# Altium project 4-wire-short.PrjPcb
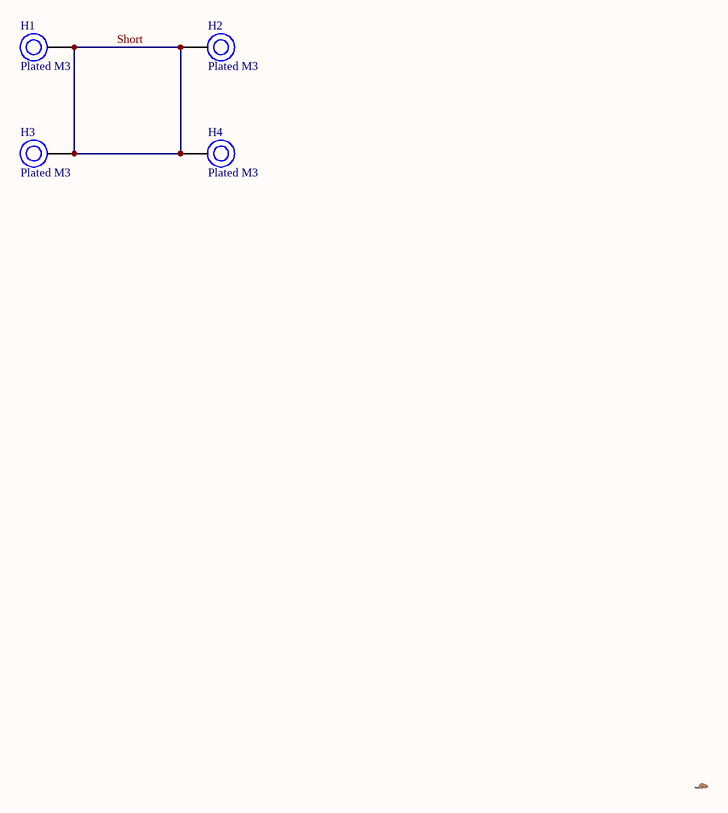
[diagram p0: main.SchDoc]
1 sheet, 5 parts. Net scope: global (net labels, ports and power ports of the same name join across sheets).
Board file: main.PcbDoc

## Sheet main.SchDoc: 4-wire-short
size 420 x 297 mm; Date: 2021-12-08; Author: Joachim Löfwander; Revision: AAA-000; SheetNumber: 1; SheetTotal: 1; Website: github.com/jlofw

### Parts
H1  Plated M3  [MountingHole_3.2mm_M3_Pad_Via_Unplated]  (no BOM)
H2  Plated M3  [MountingHole_3.2mm_M3_Pad_Via_Unplated]  (no BOM)
H3  Plated M3  [MountingHole_3.2mm_M3_Pad_Via_Unplated]  (no BOM)
H4  Plated M3  [MountingHole_3.2mm_M3_Pad_Via_Unplated]  (no BOM)
logo?  beaver  [beaver]  (value not drawn)

### Nets
Short: H1.1 H2.1 H3.1 H4.1

### Notes on the sheet
- PROJECT
- TITLE
- FILE NAME
- DATE MODIFIED
- SHEET
- REV
- OF
- AUTHOR
- WEBSITE

### Library data of the parts
H1-H4 = 2: Internal Number: 2
logo? = 4: Internal Number: 4